# EAGLE schematic devcat 05 (EAGLE 5.03)
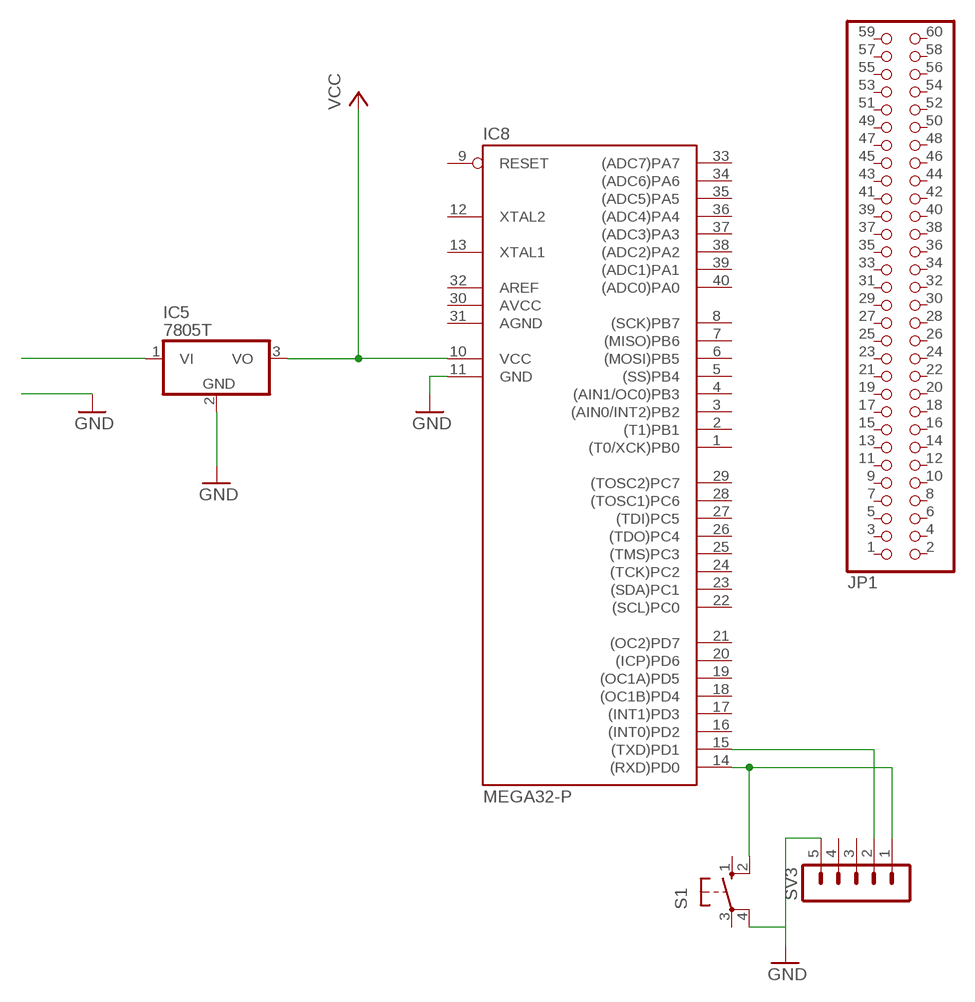
[diagram p0: schematic, sheet 1]

## Parts
IC5  7805T  [TO220H]
IC8  MEGA32-P  [DIL40]
JP1  PINHD-2X30  [2X30]
S1  10-XX  [B3F-10XX]
SV3  MA05-1  [MA05-1]

## Nets
GND: IC5.2(GND) IC8.11(GND) S1.4(P1) SV3.5
N$39: IC8.14((RXD)PD0) S1.2(S1) SV3.1
N$40: IC8.15((TXD)PD1) SV3.2
N$50: IC5.1(VI)
VCC: IC5.3(VO) IC8.10(VCC)
Unconnected: IC8.1((T0/XCK)PB0) IC8.2((T1)PB1) IC8.3((AIN0/INT2)PB2) IC8.4((AIN1/OC0)PB3) IC8.5((SS)PB4) IC8.6((MOSI)PB5) IC8.7((MISO)PB6) IC8.8((SCK)PB7) IC8.9(RESET) IC8.12(XTAL2) IC8.13(XTAL1) IC8.16((INT0)PD2) IC8.17((INT1)PD3) IC8.18((OC1B)PD4) IC8.19((OC1A)PD5) IC8.20((ICP)PD6) IC8.21((OC2)PD7) IC8.22((SCL)PC0) IC8.23((SDA)PC1) IC8.24((TCK)PC2) IC8.25((TMS)PC3) IC8.26((TDO)PC4) IC8.27((TDI)PC5) IC8.28((TOSC1)PC6) IC8.29((TOSC2)PC7) IC8.33((ADC7)PA7) IC8.34((ADC6)PA6) IC8.35((ADC5)PA5) IC8.36((ADC4)PA4) IC8.37((ADC3)PA3) IC8.38((ADC2)PA2) IC8.39((ADC1)PA1) IC8.40((ADC0)PA0) JP1.1 JP1.2 JP1.3 JP1.4 JP1.5 JP1.6 JP1.7 JP1.8 JP1.9 JP1.10 JP1.11 JP1.12 JP1.13 JP1.14 JP1.15 JP1.16 JP1.17 JP1.18 JP1.19 JP1.20 JP1.21 JP1.22 JP1.23 JP1.24 JP1.25 JP1.26 JP1.27 JP1.28 JP1.29 JP1.30 JP1.31 JP1.32 JP1.33 JP1.34 JP1.35 JP1.36 JP1.37 JP1.38 JP1.39 JP1.40 JP1.41 JP1.42 JP1.43 JP1.44 JP1.45 JP1.46 JP1.47 JP1.48 JP1.49 JP1.50 JP1.51 JP1.52 JP1.53 JP1.54 JP1.55 JP1.56 JP1.57 JP1.58 JP1.59 JP1.60 S1.1(S) S1.3(P) SV3.3 SV3.4

## Power pins joined to a net without a drawn wire
AGND: IC8.31(AGND)
AREF: IC8.32(AREF)
AVCC: IC8.30(AVCC)

## Library data of the parts
IC5 = linear:78*: Positive VOLTAGE REGULATOR Source: http://cache.national.com/ds/LM/LM78L05.pdf http://www.fairchildsemi.com/ds/LM/LM7805.pdf
IC8 = atmel:MEGA32-P: MICROCONTROLLER 32 Kbytes FLASH 2 Kbytes SRAM 1 Kbytes EEPROM USART 8-channel 10 bit ADC Source: www.atmel.com .. doc2503.pdf
JP1 = pinhead:PINHD-2X30: PIN HEADER
S1 = switch-omron:10-XX: OMRON SWITCH
SV3 = con-lstb:MA05-1: PIN HEADER